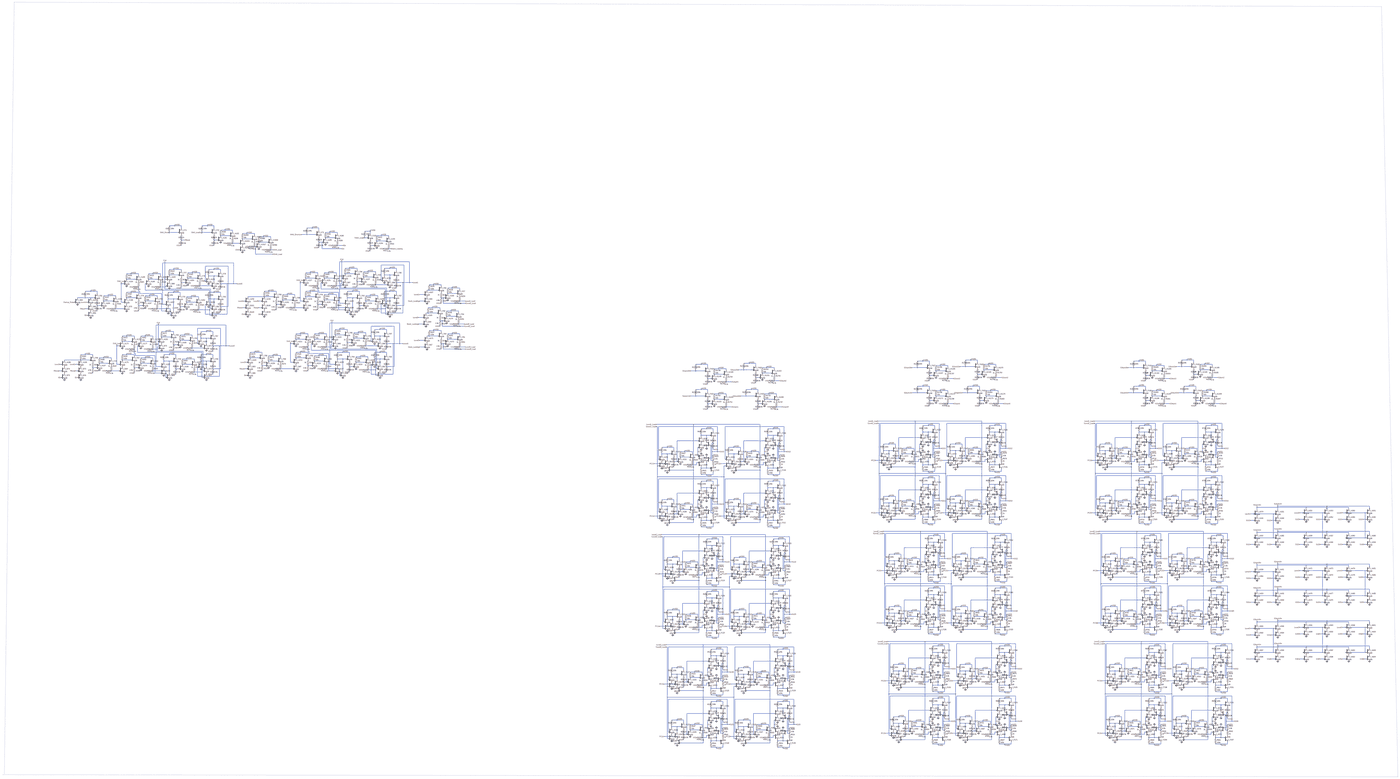
[diagram p0: schematic stack.asc, whole sheet]
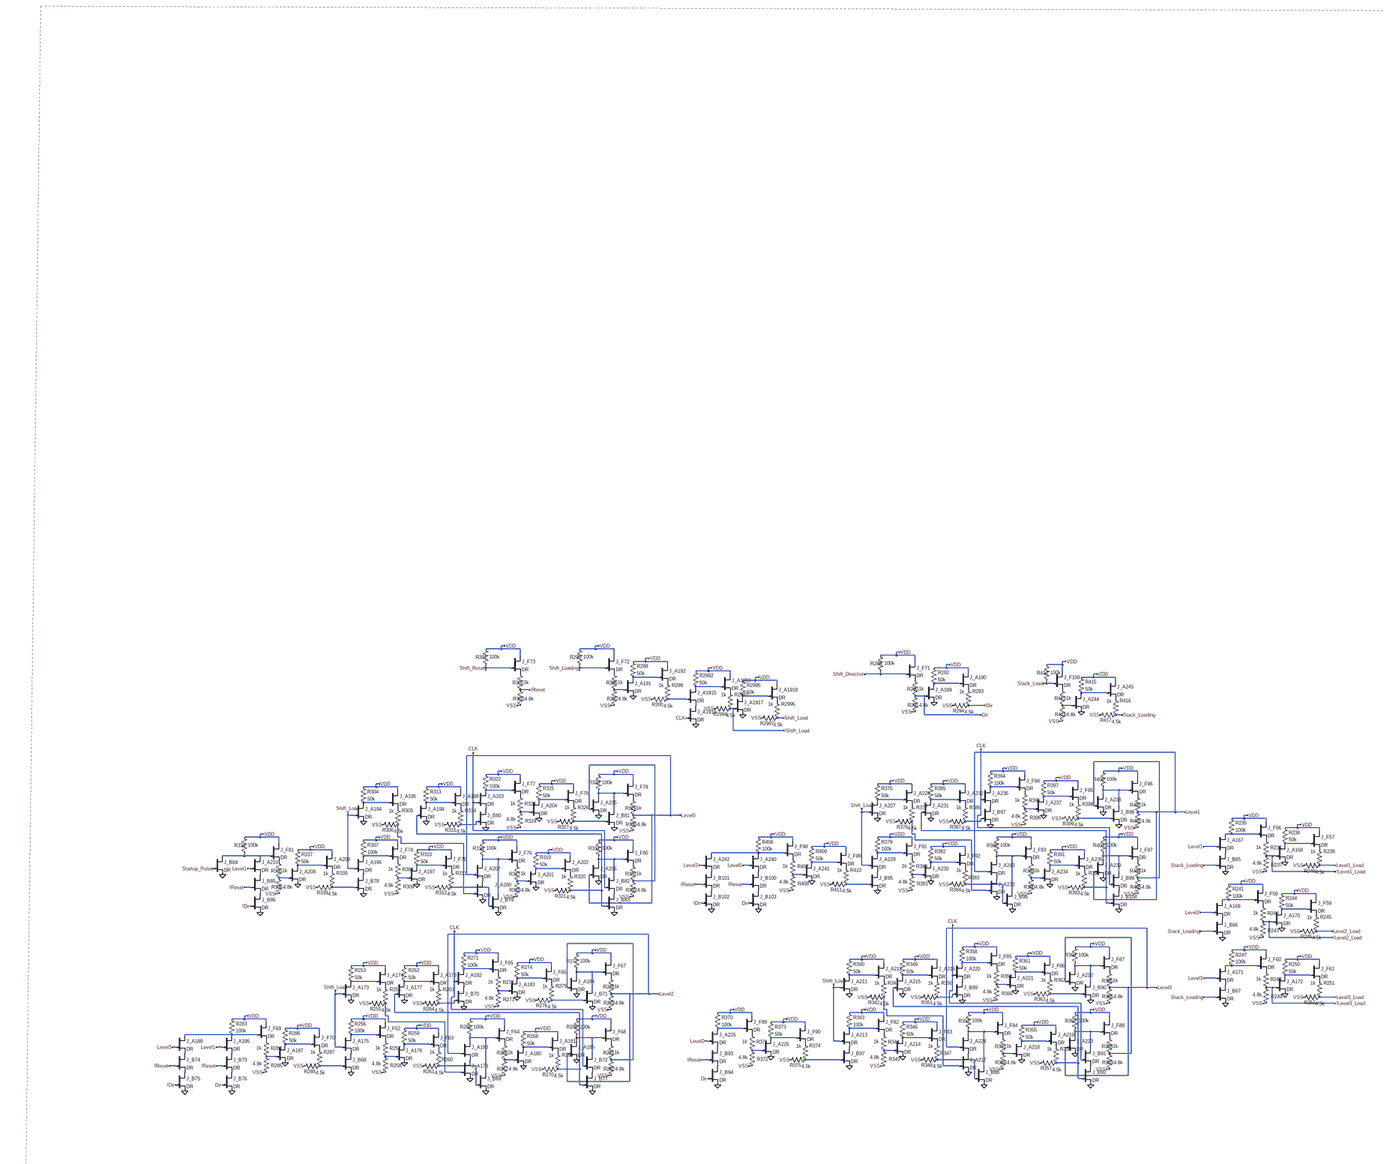
[diagram p1: schematic stack.asc, part, row 1 of 2, column 1 of 3]
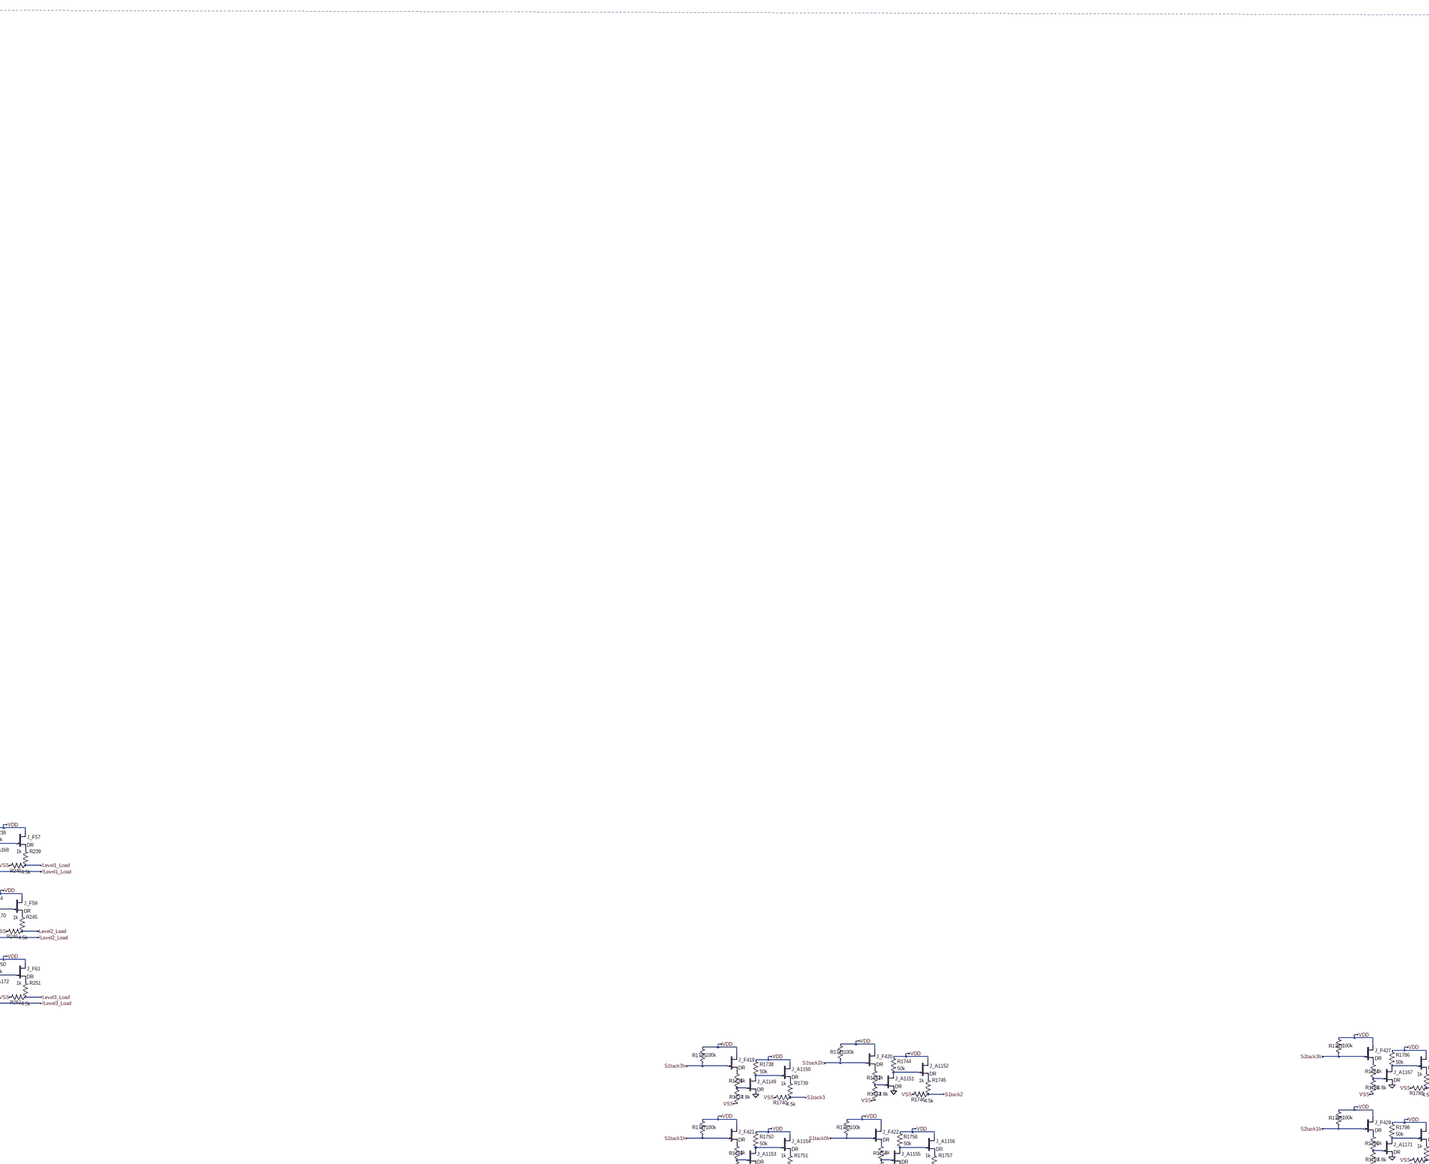
[diagram p2: schematic stack.asc, part, row 1 of 2, column 2 of 3]
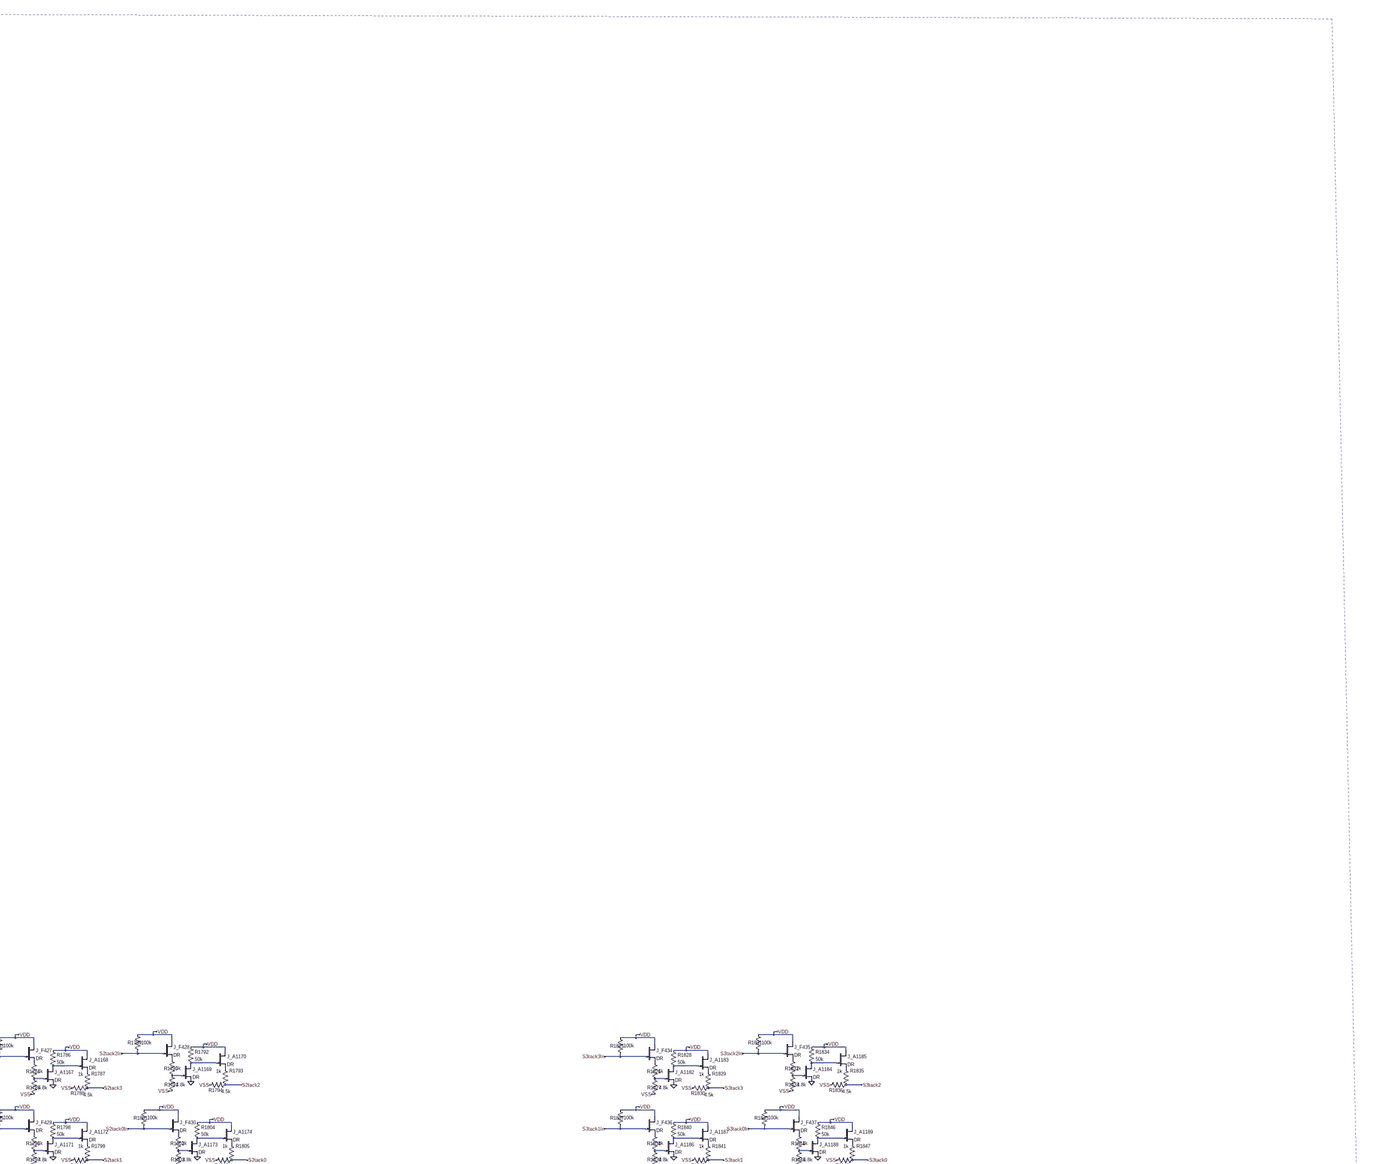
[diagram p3: schematic stack.asc, part, row 1 of 2, column 3 of 3]
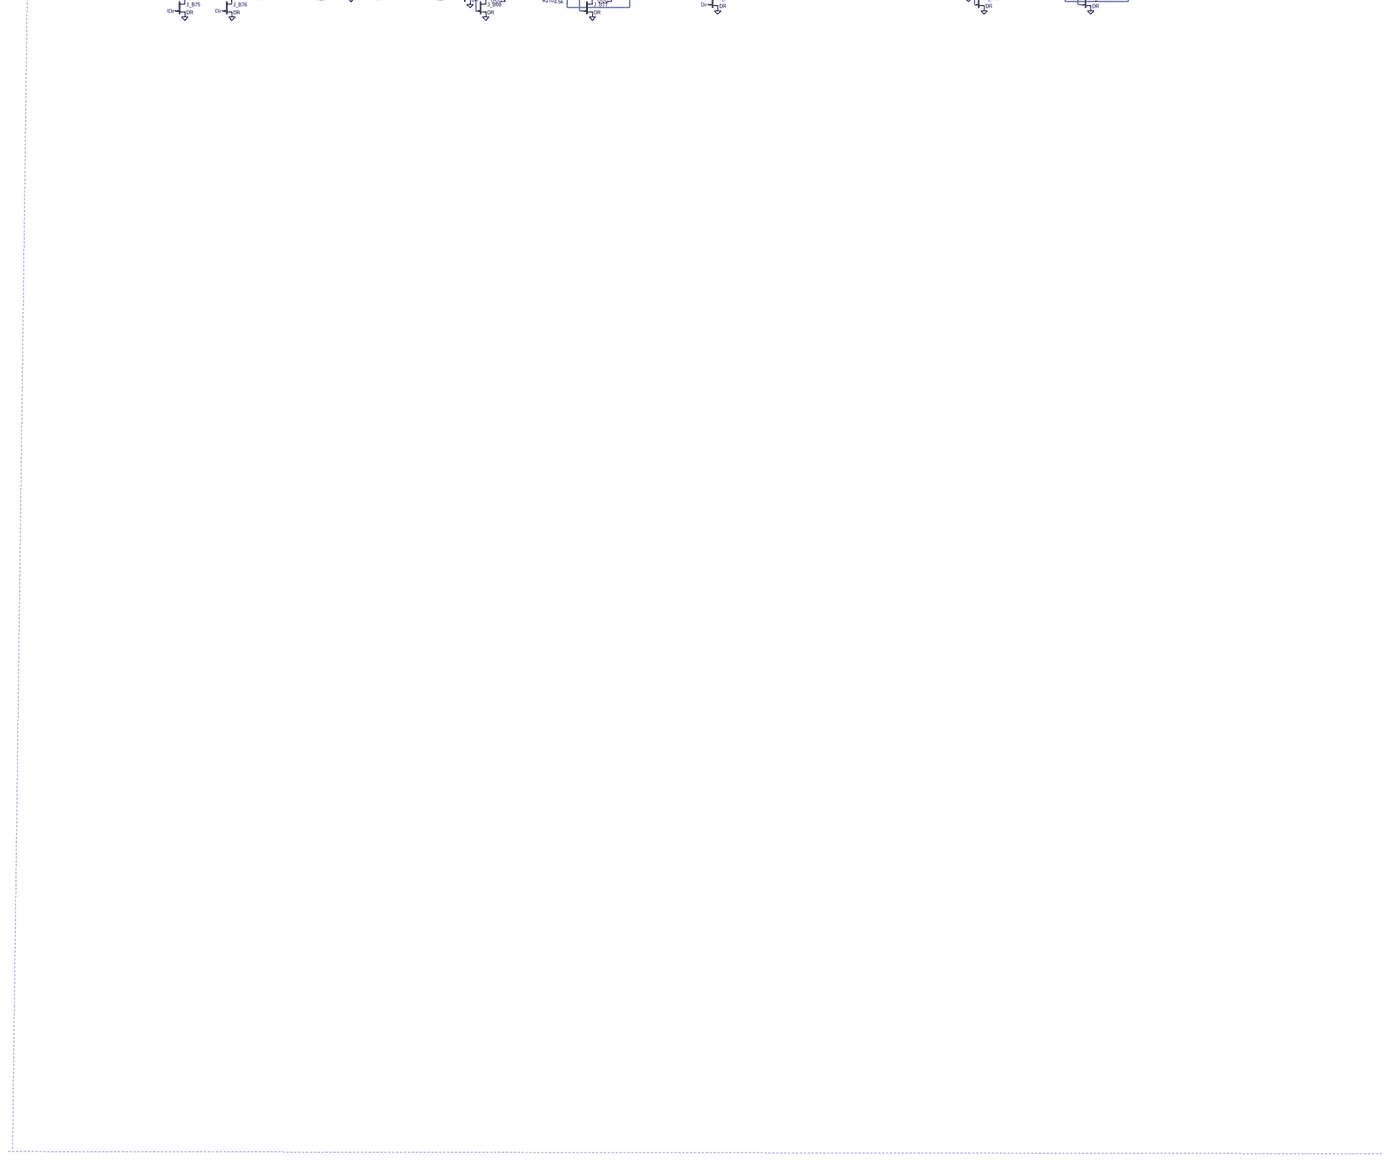
[diagram p4: schematic stack.asc, part, row 2 of 2, column 1 of 3]
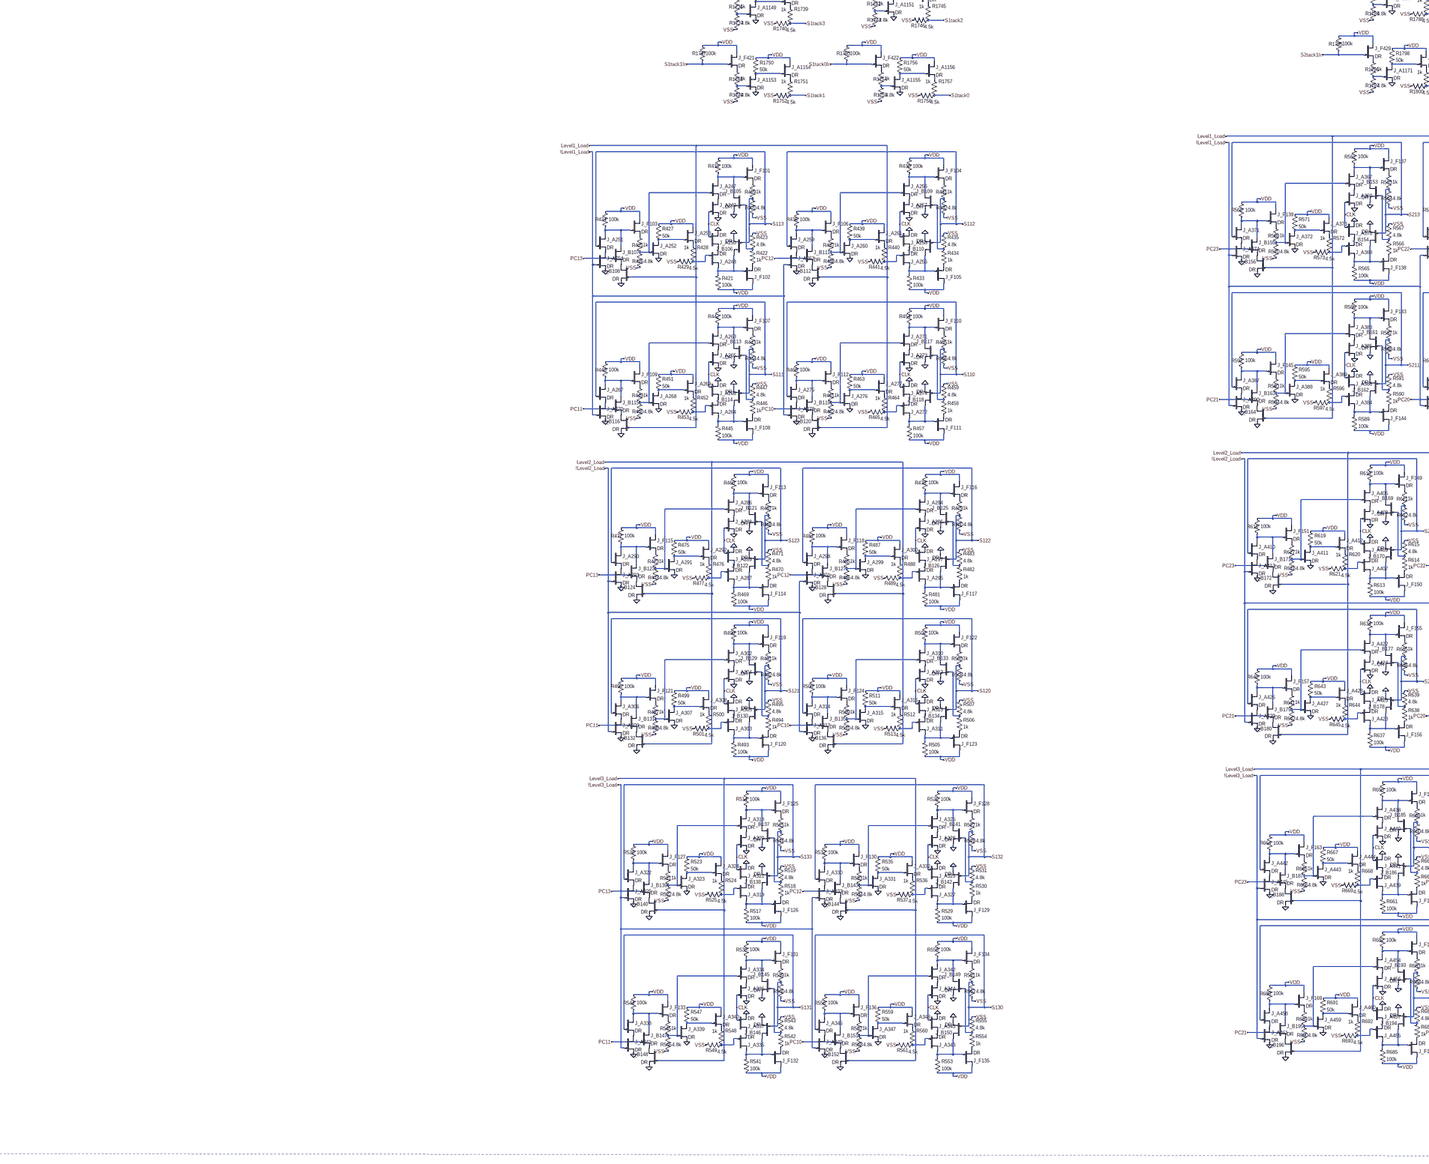
[diagram p5: schematic stack.asc, part, row 2 of 2, column 2 of 3]
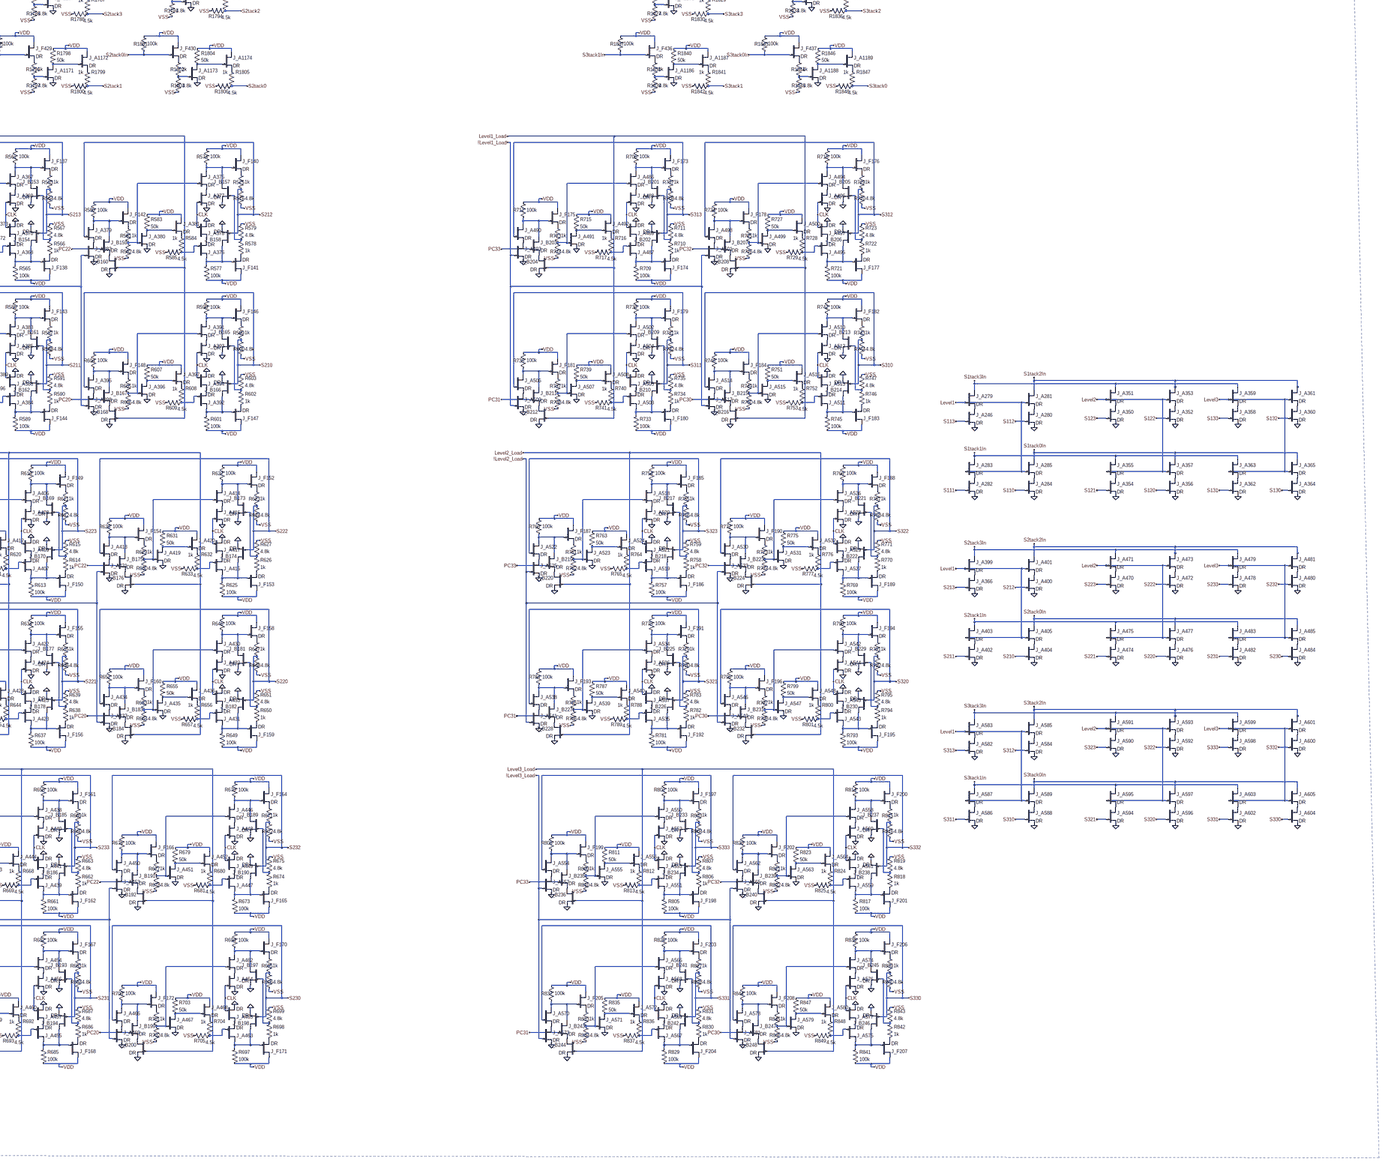
[diagram p6: schematic stack.asc, part, row 2 of 2, column 3 of 3]
* stack.asc
J_A167 N030 Level1 P001 DR
R235 VDD N030 100k
J_F56 VDD N030 P002 DR
R236 P002 !Level1_Load 1k
R237 !Level1_Load VSS 4.8k
J_B65 P001 Stack_Loading 0 DR
J_A168 N032 !Level1_Load 0 DR
R238 VDD N032 50k
J_F57 VDD N032 P003 DR
R239 P003 Level1_Load 1k
R240 Level1_Load VSS 4.5k
J_A169 N057 Level2 P004 DR
R241 VDD N057 100k
J_F58 VDD N057 P005 DR
R242 P005 !Level2_Load 1k
R243 !Level2_Load VSS 4.8k
J_B66 P004 Stack_Loading 0 DR
J_A170 N058 !Level2_Load 0 DR
R244 VDD N058 50k
J_F59 VDD N058 P006 DR
R245 P006 Level2_Load 1k
R246 Level2_Load VSS 4.5k
J_A171 N063 Level3 P007 DR
R247 VDD N063 100k
J_F60 VDD N063 P008 DR
R248 P008 !Level3_Load 1k
R249 !Level3_Load VSS 4.8k
J_B67 P007 Stack_Loading 0 DR
J_A172 N069 !Level3_Load 0 DR
R250 VDD N069 50k
J_F61 VDD N069 P009 DR
R251 P009 Level3_Load 1k
R252 Level3_Load VSS 4.5k
J_A173 N071 Shift_Load 0 DR
R253 VDD N071 50k
J_A174 VDD N071 P010 DR
R254 P010 N082 1k
R255 N082 VSS 4.5k
J_A175 N088 Shift_Load P011 DR
R256 VDD N088 100k
J_F62 VDD N088 P012 DR
R257 P012 N101 1k
R258 N101 VSS 4.8k
J_B68 P011 N107 0 DR
J_A176 N095 N101 0 DR
R259 VDD N095 50k
J_F63 VDD N095 P013 DR
R260 P013 N108 1k
R261 N108 VSS 4.5k
J_A177 N072 N081 0 DR
R262 VDD N072 50k
J_A178 VDD N072 P014 DR
R263 P014 N078 1k
R264 N078 VSS 4.5k
J_A179 P015 N082 0 DR
R265 VDD N089 100k
J_F64 VDD N089 P016 DR
R266 P016 N102 1k
R267 N102 VSS 4.8k
J_B69 N089 N108 0 DR
J_A180 N096 N102 0 DR
R268 VDD N096 50k
J_A181 VDD N096 P017 DR
R269 P017 N081 1k
R270 N081 VSS 4.5k
J_A182 N064 CLK P018 DR
R271 VDD N064 100k
J_F65 VDD N064 P019 DR
R272 P019 N074 1k
R273 N074 VSS 4.8k
J_B70 P018 N078 0 DR
J_A183 N070 N074 0 DR
R274 VDD N070 50k
J_F66 VDD N070 P020 DR
R275 P020 N077 1k
R276 N077 VSS 4.5k
J_A184 N065 N060 0 DR
R277 VDD N065 100k
J_F67 VDD N065 P021 DR
R278 P021 Level2 1k
R279 Level2 VSS 4.8k
J_B71 N065 N077 0 DR
J_A185 N090 Level2 0 DR
R280 VDD N090 100k
J_F68 VDD N090 P022 DR
R281 P022 N060 1k
R282 N060 VSS 4.8k
J_B72 N090 CLK P023 DR
J_A186 N087 Level1 P024 DR
R283 VDD N087 100k
J_F69 VDD N087 P025 DR
R284 P025 N100 1k
R285 N100 VSS 4.8k
J_B73 P024 !Reset P026 DR
J_A187 N094 N100 0 DR
R286 VDD N094 50k
J_F70 VDD N094 P027 DR
R287 P027 N107 1k
R288 N107 VSS 4.5k
J_A188 N087 Level3 P028 DR
J_B74 P028 !Reset P029 DR
J_B75 P029 !Dir 0 DR
J_B76 P026 Dir 0 DR
R289 VDD Shift_Direction 100k
J_F71 VDD Shift_Direction P030 DR
R290 P030 Dir 1k
R291 Dir VSS 4.8k
J_A189 N002 Dir 0 DR
R292 VDD N002 50k
J_A190 VDD N002 P031 DR
R293 P031 !Dir 1k
R294 !Dir VSS 4.5k
R295 VDD Shift_Loading 100k
J_F72 VDD Shift_Loading P032 DR
R296 P032 N004 1k
R297 N004 VSS 4.8k
J_A191 N001 N004 0 DR
R298 VDD N001 50k
J_A192 VDD N001 P033 DR
R299 P033 N007 1k
R300 N007 VSS 4.5k
R301 VDD Shift_Reset 100k
J_F73 VDD Shift_Reset P034 DR
R302 P034 !Reset 1k
R303 !Reset VSS 4.8k
J_A193 N089 Level2 P015 DR
J_B77 P023 N081 0 DR
J_A194 N019 Shift_Load 0 DR
R304 VDD N019 50k
J_A195 VDD N019 P035 DR
R305 P035 N031 1k
R306 N031 VSS 4.5k
J_A196 N036 Shift_Load P036 DR
R307 VDD N036 100k
J_F74 VDD N036 P037 DR
R308 P037 N050 1k
R309 N050 VSS 4.8k
J_B78 P036 N055 0 DR
J_A197 N044 N050 0 DR
R310 VDD N044 50k
J_F75 VDD N044 P038 DR
R311 P038 N056 1k
R312 N056 VSS 4.5k
J_A198 N020 N028 0 DR
R313 VDD N020 50k
J_A199 VDD N020 P039 DR
R314 P039 N026 1k
R315 N026 VSS 4.5k
J_A200 P040 N031 0 DR
R316 VDD N039 100k
J_F76 VDD N039 P041 DR
R317 P041 N052 1k
R318 N052 VSS 4.8k
J_B79 N039 N056 0 DR
J_A201 N046 N052 0 DR
R319 VDD N046 50k
J_A202 VDD N046 P042 DR
R320 P042 N028 1k
R321 N028 VSS 4.5k
J_A203 N012 CLK P043 DR
R322 VDD N012 100k
J_F77 VDD N012 P044 DR
R323 P044 N022 1k
R324 N022 VSS 4.8k
J_B80 P043 N026 0 DR
J_A204 N016 N022 0 DR
R325 VDD N016 50k
J_F78 VDD N016 P045 DR
R326 P045 N024 1k
R327 N024 VSS 4.5k
J_A205 N014 N010 0 DR
R328 VDD N014 100k
J_F79 VDD N014 P046 DR
R329 P046 Level0 1k
R330 Level0 VSS 4.8k
J_B81 N014 N024 0 DR
J_A206 N040 Level0 0 DR
R331 VDD N040 100k
J_F80 VDD N040 P047 DR
R332 P047 N010 1k
R333 N010 VSS 4.8k
J_B82 N040 CLK P048 DR
J_A207 N039 Level0 P040 DR
J_B83 P048 N028 0 DR
R334 VDD N035 100k
J_F81 VDD N035 P049 DR
R335 P049 N049 1k
R336 N049 VSS 4.8k
J_B84 N035 Startup_Pulse 0 DR
J_A208 N043 N049 0 DR
R337 VDD N043 50k
J_A209 VDD N043 P050 DR
R338 P050 N055 1k
R339 N055 VSS 4.5k
J_A210 N035 Level1 P051 DR
J_B85 P051 !Reset P052 DR
J_B86 P052 !Dir 0 DR
J_A211 N067 Shift_Load 0 DR
R340 VDD N067 50k
J_A212 VDD N067 P053 DR
R341 P053 N080 1k
R342 N080 VSS 4.5k
J_A213 N084 Shift_Load P054 DR
R343 VDD N084 100k
J_F82 VDD N084 P055 DR
R344 P055 N098 1k
R345 N098 VSS 4.8k
J_B87 P054 N103 0 DR
J_A214 N092 N098 0 DR
R346 VDD N092 50k
J_F83 VDD N092 P056 DR
R347 P056 N104 1k
R348 N104 VSS 4.5k
J_A215 N068 N079 0 DR
R349 VDD N068 50k
J_A216 VDD N068 P057 DR
R350 P057 N076 1k
R351 N076 VSS 4.5k
J_A217 P058 N080 0 DR
R352 VDD N085 100k
J_F84 VDD N085 P059 DR
R353 P059 N099 1k
R354 N099 VSS 4.8k
J_B88 N085 N104 0 DR
J_A218 N093 N099 0 DR
R355 VDD N093 50k
J_A219 VDD N093 P060 DR
R356 P060 N079 1k
R357 N079 VSS 4.5k
J_A220 N061 CLK P061 DR
R358 VDD N061 100k
J_F85 VDD N061 P062 DR
R359 P062 N073 1k
R360 N073 VSS 4.8k
J_B89 P061 N076 0 DR
J_A221 N066 N073 0 DR
R361 VDD N066 50k
J_F86 VDD N066 P063 DR
R362 P063 N075 1k
R363 N075 VSS 4.5k
J_A222 N062 N059 0 DR
R364 VDD N062 100k
J_F87 VDD N062 P064 DR
R365 P064 Level3 1k
R366 Level3 VSS 4.8k
J_B90 N062 N075 0 DR
J_A223 N086 Level3 0 DR
R367 VDD N086 100k
J_F88 VDD N086 P065 DR
R368 P065 N059 1k
R369 N059 VSS 4.8k
J_B91 N086 CLK P066 DR
J_A224 N085 Level3 P058 DR
J_B92 P066 N079 0 DR
J_A225 N083 Level2 P067 DR
R370 VDD N083 100k
J_F89 VDD N083 P068 DR
R371 P068 N097 1k
R372 N097 VSS 4.8k
J_B93 P067 !Reset P069 DR
J_A226 N091 N097 0 DR
R373 VDD N091 50k
J_F90 VDD N091 P070 DR
R374 P070 N103 1k
R375 N103 VSS 4.5k
J_B94 P069 Dir 0 DR
J_A227 N017 Shift_Load 0 DR
R376 VDD N017 50k
J_A228 VDD N017 P071 DR
R377 P071 N029 1k
R378 N029 VSS 4.5k
J_A229 N034 Shift_Load P072 DR
R379 VDD N034 100k
J_F91 VDD N034 P073 DR
R380 P073 N048 1k
R381 N048 VSS 4.8k
J_B95 P072 N053 0 DR
J_A230 N042 N048 0 DR
R382 VDD N042 50k
J_F92 VDD N042 P074 DR
R383 P074 N054 1k
R384 N054 VSS 4.5k
J_A231 N018 N027 0 DR
R385 VDD N018 50k
J_A232 VDD N018 P075 DR
R386 P075 N025 1k
R387 N025 VSS 4.5k
J_A233 P076 N029 0 DR
R388 VDD N037 100k
J_F93 VDD N037 P077 DR
R389 P077 N051 1k
R390 N051 VSS 4.8k
J_B96 N037 N054 0 DR
J_A234 N045 N051 0 DR
R391 VDD N045 50k
J_A235 VDD N045 P078 DR
R392 P078 N027 1k
R393 N027 VSS 4.5k
J_A236 N011 CLK P079 DR
R394 VDD N011 100k
J_F94 VDD N011 P080 DR
R395 P080 N021 1k
R396 N021 VSS 4.8k
J_B97 P079 N025 0 DR
J_A237 N015 N021 0 DR
R397 VDD N015 50k
J_F95 VDD N015 P081 DR
R398 P081 N023 1k
R399 N023 VSS 4.5k
J_A238 N013 N009 0 DR
R400 VDD N013 100k
J_F96 VDD N013 P082 DR
R401 P082 Level1 1k
R402 Level1 VSS 4.8k
J_B98 N013 N023 0 DR
J_A239 N038 Level1 0 DR
R403 VDD N038 100k
J_F97 VDD N038 P083 DR
R404 P083 N009 1k
R405 N009 VSS 4.8k
J_B99 N038 CLK P084 DR
J_A240 N033 Level0 P085 DR
R406 VDD N033 100k
J_F98 VDD N033 P086 DR
R407 P086 N047 1k
R408 N047 VSS 4.8k
J_B100 P085 !Reset P087 DR
J_A241 N041 N047 0 DR
R409 VDD N041 50k
J_F99 VDD N041 P088 DR
R410 P088 N053 1k
R411 N053 VSS 4.5k
J_A242 N033 Level2 P089 DR
J_B101 P089 !Reset P090 DR
J_B102 P090 !Dir 0 DR
J_B103 P087 Dir 0 DR
J_A243 N037 Level1 P076 DR
J_B104 P084 N027 0 DR
R412 VDD Stack_Load 100k
J_F100 VDD Stack_Load P091 DR
R413 P091 N008 1k
R414 N008 VSS 4.8k
J_A244 N005 N008 0 DR
R415 VDD N005 50k
J_A245 VDD N005 P092 DR
R416 P092 Stack_Loading 1k
R417 Stack_Loading VSS 4.5k
J_A246 P093 S113 0 DR
J_A247 N135 N141 P094 DR
R418 VDD N135 100k
J_F101 VDD N135 P095 DR
R419 P095 S113 1k
R420 S113 VSS 4.8k
J_B105 N135 N147 0 DR
J_A248 N171 N165 P096 DR
R421 VDD N171 100k
J_F102 VDD N171 P097 DR
R422 P097 N147 1k
R423 N147 VSS 4.8k
J_B106 N171 S113 0 DR
J_A249 P094 CLK 0 DR
J_A250 P096 CLK 0 DR
J_A251 N153 S113 P098 DR
R424 VDD N153 100k
J_F103 VDD N153 P099 DR
R425 P099 N141 1k
R426 N141 VSS 4.8k
J_B107 N153 PC13 P100 DR
J_A252 N159 N141 0 DR
R427 VDD N159 50k
J_A253 VDD N159 P101 DR
R428 P101 N165 1k
R429 N165 VSS 4.5k
J_A254 P098 !Level1_Load 0 DR
J_B108 P100 Level1_Load 0 DR
J_A255 N136 N142 P102 DR
R430 VDD N136 100k
J_F104 VDD N136 P103 DR
R431 P103 S112 1k
R432 S112 VSS 4.8k
J_B109 N136 N148 0 DR
J_A256 N172 N166 P104 DR
R433 VDD N172 100k
J_F105 VDD N172 P105 DR
R434 P105 N148 1k
R435 N148 VSS 4.8k
J_B110 N172 S112 0 DR
J_A257 P102 CLK 0 DR
J_A258 P104 CLK 0 DR
J_A259 N154 S112 P106 DR
R436 VDD N154 100k
J_F106 VDD N154 P107 DR
R437 P107 N142 1k
R438 N142 VSS 4.8k
J_B111 N154 PC12 P108 DR
J_A260 N160 N142 0 DR
R439 VDD N160 50k
J_A261 VDD N160 P109 DR
R440 P109 N166 1k
R441 N166 VSS 4.5k
J_A262 P106 !Level1_Load 0 DR
J_B112 P108 Level1_Load 0 DR
J_A263 N177 N183 P110 DR
R442 VDD N177 100k
J_F107 VDD N177 P111 DR
R443 P111 S111 1k
R444 S111 VSS 4.8k
J_B113 N177 N189 0 DR
J_A264 N213 N207 P112 DR
R445 VDD N213 100k
J_F108 VDD N213 P113 DR
R446 P113 N189 1k
R447 N189 VSS 4.8k
J_B114 N213 S111 0 DR
J_A265 P110 CLK 0 DR
J_A266 P112 CLK 0 DR
J_A267 N195 S111 P114 DR
R448 VDD N195 100k
J_F109 VDD N195 P115 DR
R449 P115 N183 1k
R450 N183 VSS 4.8k
J_B115 N195 PC11 P116 DR
J_A268 N201 N183 0 DR
R451 VDD N201 50k
J_A269 VDD N201 P117 DR
R452 P117 N207 1k
R453 N207 VSS 4.5k
J_A270 P114 !Level1_Load 0 DR
J_B116 P116 Level1_Load 0 DR
J_A271 N178 N184 P118 DR
R454 VDD N178 100k
J_F110 VDD N178 P119 DR
R455 P119 S110 1k
R456 S110 VSS 4.8k
J_B117 N178 N190 0 DR
J_A272 N214 N208 P120 DR
R457 VDD N214 100k
J_F111 VDD N214 P121 DR
R458 P121 N190 1k
R459 N190 VSS 4.8k
J_B118 N214 S110 0 DR
J_A273 P118 CLK 0 DR
J_A274 P120 CLK 0 DR
J_A275 N196 S110 P122 DR
R460 VDD N196 100k
J_F112 VDD N196 P123 DR
R461 P123 N184 1k
R462 N184 VSS 4.8k
J_B119 N196 PC10 P124 DR
J_A276 N202 N184 0 DR
R463 VDD N202 50k
J_A277 VDD N202 P125 DR
R464 P125 N208 1k
R465 N208 VSS 4.5k
J_A278 P122 !Level1_Load 0 DR
J_B120 P124 Level1_Load 0 DR
J_A279 S1tack3In Level1 P093 DR
J_A280 P126 S112 0 DR
J_A281 S1tack2In Level1 P126 DR
J_A282 P127 S111 0 DR
J_A283 S1tack1In Level1 P127 DR
J_A284 P128 S110 0 DR
J_A285 S1tack0In Level1 P128 DR
J_A286 N219 N225 P129 DR
R466 VDD N219 100k
J_F113 VDD N219 P130 DR
R467 P130 S123 1k
R468 S123 VSS 4.8k
J_B121 N219 N231 0 DR
J_A287 N255 N249 P131 DR
R469 VDD N255 100k
J_F114 VDD N255 P132 DR
R470 P132 N231 1k
R471 N231 VSS 4.8k
J_B122 N255 S123 0 DR
J_A288 P129 CLK 0 DR
J_A289 P131 CLK 0 DR
J_A290 N237 S123 P133 DR
R472 VDD N237 100k
J_F115 VDD N237 P134 DR
R473 P134 N225 1k
R474 N225 VSS 4.8k
J_B123 N237 PC13 P135 DR
J_A291 N243 N225 0 DR
R475 VDD N243 50k
J_A292 VDD N243 P136 DR
R476 P136 N249 1k
R477 N249 VSS 4.5k
J_A293 P133 !Level2_Load 0 DR
J_B124 P135 Level2_Load 0 DR
J_A294 N220 N226 P137 DR
R478 VDD N220 100k
J_F116 VDD N220 P138 DR
R479 P138 S122 1k
R480 S122 VSS 4.8k
J_B125 N220 N232 0 DR
J_A295 N256 N250 P139 DR
R481 VDD N256 100k
J_F117 VDD N256 P140 DR
R482 P140 N232 1k
R483 N232 VSS 4.8k
J_B126 N256 S122 0 DR
J_A296 P137 CLK 0 DR
J_A297 P139 CLK 0 DR
J_A298 N238 S122 P141 DR
R484 VDD N238 100k
J_F118 VDD N238 P142 DR
R485 P142 N226 1k
R486 N226 VSS 4.8k
J_B127 N238 PC12 P143 DR
J_A299 N244 N226 0 DR
R487 VDD N244 50k
J_A300 VDD N244 P144 DR
R488 P144 N250 1k
R489 N250 VSS 4.5k
J_A301 P141 !Level2_Load 0 DR
J_B128 P143 Level2_Load 0 DR
J_A302 N261 N267 P145 DR
R490 VDD N261 100k
J_F119 VDD N261 P146 DR
R491 P146 S121 1k
R492 S121 VSS 4.8k
J_B129 N261 N273 0 DR
J_A303 N297 N291 P147 DR
R493 VDD N297 100k
J_F120 VDD N297 P148 DR
R494 P148 N273 1k
R495 N273 VSS 4.8k
J_B130 N297 S121 0 DR
J_A304 P145 CLK 0 DR
J_A305 P147 CLK 0 DR
J_A306 N279 S121 P149 DR
R496 VDD N279 100k
J_F121 VDD N279 P150 DR
R497 P150 N267 1k
R498 N267 VSS 4.8k
J_B131 N279 PC11 P151 DR
J_A307 N285 N267 0 DR
R499 VDD N285 50k
J_A308 VDD N285 P152 DR
R500 P152 N291 1k
R501 N291 VSS 4.5k
J_A309 P149 !Level2_Load 0 DR
J_B132 P151 Level2_Load 0 DR
J_A310 N262 N268 P153 DR
R502 VDD N262 100k
J_F122 VDD N262 P154 DR
R503 P154 S120 1k
R504 S120 VSS 4.8k
J_B133 N262 N274 0 DR
J_A311 N298 N292 P155 DR
R505 VDD N298 100k
J_F123 VDD N298 P156 DR
R506 P156 N274 1k
R507 N274 VSS 4.8k
J_B134 N298 S120 0 DR
J_A312 P153 CLK 0 DR
J_A313 P155 CLK 0 DR
J_A314 N280 S120 P157 DR
R508 VDD N280 100k
J_F124 VDD N280 P158 DR
R509 P158 N268 1k
R510 N268 VSS 4.8k
J_B135 N280 PC10 P159 DR
J_A315 N286 N268 0 DR
R511 VDD N286 50k
J_A316 VDD N286 P160 DR
R512 P160 N292 1k
R513 N292 VSS 4.5k
J_A317 P157 !Level2_Load 0 DR
J_B136 P159 Level2_Load 0 DR
J_A318 N303 N309 P161 DR
R514 VDD N303 100k
J_F125 VDD N303 P162 DR
R515 P162 S133 1k
R516 S133 VSS 4.8k
J_B137 N303 N315 0 DR
J_A319 N339 N333 P163 DR
R517 VDD N339 100k
J_F126 VDD N339 P164 DR
R518 P164 N315 1k
R519 N315 VSS 4.8k
J_B138 N339 S133 0 DR
J_A320 P161 CLK 0 DR
J_A321 P163 CLK 0 DR
J_A322 N321 S133 P165 DR
R520 VDD N321 100k
J_F127 VDD N321 P166 DR
R521 P166 N309 1k
R522 N309 VSS 4.8k
J_B139 N321 PC13 P167 DR
J_A323 N327 N309 0 DR
R523 VDD N327 50k
J_A324 VDD N327 P168 DR
R524 P168 N333 1k
R525 N333 VSS 4.5k
J_A325 P165 !Level3_Load 0 DR
J_B140 P167 Level3_Load 0 DR
J_A326 N304 N310 P169 DR
R526 VDD N304 100k
J_F128 VDD N304 P170 DR
R527 P170 S132 1k
R528 S132 VSS 4.8k
J_B141 N304 N316 0 DR
J_A327 N340 N334 P171 DR
R529 VDD N340 100k
J_F129 VDD N340 P172 DR
R530 P172 N316 1k
R531 N316 VSS 4.8k
J_B142 N340 S132 0 DR
J_A328 P169 CLK 0 DR
J_A329 P171 CLK 0 DR
J_A330 N322 S132 P173 DR
R532 VDD N322 100k
J_F130 VDD N322 P174 DR
R533 P174 N310 1k
R534 N310 VSS 4.8k
J_B143 N322 PC12 P175 DR
J_A331 N328 N310 0 DR
R535 VDD N328 50k
J_A332 VDD N328 P176 DR
R536 P176 N334 1k
R537 N334 VSS 4.5k
J_A333 P173 !Level3_Load 0 DR
J_B144 P175 Level3_Load 0 DR
J_A334 N345 N351 P177 DR
R538 VDD N345 100k
J_F131 VDD N345 P178 DR
R539 P178 S131 1k
R540 S131 VSS 4.8k
J_B145 N345 N357 0 DR
J_A335 N381 N375 P179 DR
R541 VDD N381 100k
J_F132 VDD N381 P180 DR
R542 P180 N357 1k
R543 N357 VSS 4.8k
J_B146 N381 S131 0 DR
J_A336 P177 CLK 0 DR
J_A337 P179 CLK 0 DR
J_A338 N363 S131 P181 DR
R544 VDD N363 100k
J_F133 VDD N363 P182 DR
R545 P182 N351 1k
R546 N351 VSS 4.8k
J_B147 N363 PC11 P183 DR
J_A339 N369 N351 0 DR
R547 VDD N369 50k
J_A340 VDD N369 P184 DR
R548 P184 N375 1k
R549 N375 VSS 4.5k
J_A341 P181 !Level3_Load 0 DR
J_B148 P183 Level3_Load 0 DR
J_A342 N346 N352 P185 DR
R550 VDD N346 100k
J_F134 VDD N346 P186 DR
R551 P186 S130 1k
R552 S130 VSS 4.8k
J_B149 N346 N358 0 DR
J_A343 N382 N376 P187 DR
R553 VDD N382 100k
J_F135 VDD N382 P188 DR
R554 P188 N358 1k
R555 N358 VSS 4.8k
J_B150 N382 S130 0 DR
J_A344 P185 CLK 0 DR
J_A345 P187 CLK 0 DR
J_A346 N364 S130 P189 DR
R556 VDD N364 100k
J_F136 VDD N364 P190 DR
R557 P190 N352 1k
R558 N352 VSS 4.8k
J_B151 N364 PC10 P191 DR
J_A347 N370 N352 0 DR
R559 VDD N370 50k
J_A348 VDD N370 P192 DR
R560 P192 N376 1k
R561 N376 VSS 4.5k
J_A349 P189 !Level3_Load 0 DR
J_B152 P191 Level3_Load 0 DR
J_A350 P193 S123 0 DR
J_A351 S1tack3In Level2 P193 DR
J_A352 P194 S122 0 DR
J_A353 S1tack2In Level2 P194 DR
J_A354 P195 S121 0 DR
J_A355 S1tack1In Level2 P195 DR
J_A356 P196 S120 0 DR
J_A357 S1tack0In Level2 P196 DR
J_A358 P197 S133 0 DR
J_A359 S1tack3In Level3 P197 DR
J_A360 P198 S132 0 DR
J_A361 S1tack2In Level3 P198 DR
J_A362 P199 S131 0 DR
J_A363 S1tack1In Level3 P199 DR
J_A364 P200 S130 0 DR
J_A365 S1tack0In Level3 P200 DR
J_A366 P201 S213 0 DR
J_A367 N131 N137 P202 DR
R562 VDD N131 100k
J_F137 VDD N131 P203 DR
R563 P203 S213 1k
R564 S213 VSS 4.8k
J_B153 N131 N143 0 DR
J_A368 N167 N161 P204 DR
R565 VDD N167 100k
J_F138 VDD N167 P205 DR
R566 P205 N143 1k
R567 N143 VSS 4.8k
J_B154 N167 S213 0 DR
J_A369 P202 CLK 0 DR
J_A370 P204 CLK 0 DR
J_A371 N149 S213 P206 DR
R568 VDD N149 100k
J_F139 VDD N149 P207 DR
R569 P207 N137 1k
R570 N137 VSS 4.8k
J_B155 N149 PC23 P208 DR
J_A372 N155 N137 0 DR
R571 VDD N155 50k
J_A373 VDD N155 P209 DR
R572 P209 N161 1k
R573 N161 VSS 4.5k
J_A374 P206 !Level1_Load 0 DR
J_B156 P208 Level1_Load 0 DR
J_A375 N132 N138 P210 DR
R574 VDD N132 100k
J_F140 VDD N132 P211 DR
R575 P211 S212 1k
R576 S212 VSS 4.8k
J_B157 N132 N144 0 DR
J_A376 N168 N162 P212 DR
R577 VDD N168 100k
J_F141 VDD N168 P213 DR
R578 P213 N144 1k
R579 N144 VSS 4.8k
J_B158 N168 S212 0 DR
J_A377 P210 CLK 0 DR
J_A378 P212 CLK 0 DR
J_A379 N150 S212 P214 DR
R580 VDD N150 100k
J_F142 VDD N150 P215 DR
R581 P215 N138 1k
R582 N138 VSS 4.8k
J_B159 N150 PC22 P216 DR
J_A380 N156 N138 0 DR
R583 VDD N156 50k
J_A381 VDD N156 P217 DR
R584 P217 N162 1k
R585 N162 VSS 4.5k
J_A382 P214 !Level1_Load 0 DR
J_B160 P216 Level1_Load 0 DR
J_A383 N173 N179 P218 DR
R586 VDD N173 100k
J_F143 VDD N173 P219 DR
R587 P219 S211 1k
R588 S211 VSS 4.8k
J_B161 N173 N185 0 DR
J_A384 N209 N203 P220 DR
R589 VDD N209 100k
J_F144 VDD N209 P221 DR
R590 P221 N185 1k
R591 N185 VSS 4.8k
J_B162 N209 S211 0 DR
J_A385 P218 CLK 0 DR
J_A386 P220 CLK 0 DR
J_A387 N191 S211 P222 DR
R592 VDD N191 100k
J_F145 VDD N191 P223 DR
R593 P223 N179 1k
R594 N179 VSS 4.8k
J_B163 N191 PC21 P224 DR
J_A388 N197 N179 0 DR
R595 VDD N197 50k
J_A389 VDD N197 P225 DR
R596 P225 N203 1k
R597 N203 VSS 4.5k
J_A390 P222 !Level1_Load 0 DR
J_B164 P224 Level1_Load 0 DR
J_A391 N174 N180 P226 DR
R598 VDD N174 100k
J_F146 VDD N174 P227 DR
R599 P227 S210 1k
R600 S210 VSS 4.8k
J_B165 N174 N186 0 DR
J_A392 N210 N204 P228 DR
R601 VDD N210 100k
J_F147 VDD N210 P229 DR
R602 P229 N186 1k
R603 N186 VSS 4.8k
J_B166 N210 S210 0 DR
J_A393 P226 CLK 0 DR
J_A394 P228 CLK 0 DR
J_A395 N192 S210 P230 DR
R604 VDD N192 100k
J_F148 VDD N192 P231 DR
R605 P231 N180 1k
R606 N180 VSS 4.8k
J_B167 N192 PC20 P232 DR
J_A396 N198 N180 0 DR
R607 VDD N198 50k
J_A397 VDD N198 P233 DR
R608 P233 N204 1k
R609 N204 VSS 4.5k
J_A398 P230 !Level1_Load 0 DR
J_B168 P232 Level1_Load 0 DR
J_A399 S2tack3In Level1 P201 DR
J_A400 P234 S212 0 DR
J_A401 S2tack2In Level1 P234 DR
J_A402 P235 S211 0 DR
J_A403 S2tack1In Level1 P235 DR
J_A404 P236 S210 0 DR
J_A405 S2tack0In Level1 P236 DR
J_A406 N215 N221 P237 DR
R610 VDD N215 100k
J_F149 VDD N215 P238 DR
R611 P238 S223 1k
R612 S223 VSS 4.8k
J_B169 N215 N227 0 DR
J_A407 N251 N245 P239 DR
R613 VDD N251 100k
J_F150 VDD N251 P240 DR
R614 P240 N227 1k
R615 N227 VSS 4.8k
J_B170 N251 S223 0 DR
J_A408 P237 CLK 0 DR
J_A409 P239 CLK 0 DR
J_A410 N233 S223 P241 DR
R616 VDD N233 100k
J_F151 VDD N233 P242 DR
R617 P242 N221 1k
R618 N221 VSS 4.8k
J_B171 N233 PC23 P243 DR
J_A411 N239 N221 0 DR
R619 VDD N239 50k
J_A412 VDD N239 P244 DR
R620 P244 N245 1k
R621 N245 VSS 4.5k
J_A413 P241 !Level2_Load 0 DR
J_B172 P243 Level2_Load 0 DR
J_A414 N216 N222 P245 DR
R622 VDD N216 100k
J_F152 VDD N216 P246 DR
R623 P246 S222 1k
R624 S222 VSS 4.8k
J_B173 N216 N228 0 DR
J_A415 N252 N246 P247 DR
R625 VDD N252 100k
J_F153 VDD N252 P248 DR
R626 P248 N228 1k
R627 N228 VSS 4.8k
J_B174 N252 S222 0 DR
J_A416 P245 CLK 0 DR
J_A417 P247 CLK 0 DR
J_A418 N234 S222 P249 DR
R628 VDD N234 100k
J_F154 VDD N234 P250 DR
R629 P250 N222 1k
R630 N222 VSS 4.8k
J_B175 N234 PC22 P251 DR
J_A419 N240 N222 0 DR
R631 VDD N240 50k
J_A420 VDD N240 P252 DR
R632 P252 N246 1k
R633 N246 VSS 4.5k
J_A421 P249 !Level2_Load 0 DR
J_B176 P251 Level2_Load 0 DR
J_A422 N257 N263 P253 DR
R634 VDD N257 100k
J_F155 VDD N257 P254 DR
R635 P254 S221 1k
R636 S221 VSS 4.8k
J_B177 N257 N269 0 DR
J_A423 N293 N287 P255 DR
R637 VDD N293 100k
J_F156 VDD N293 P256 DR
R638 P256 N269 1k
R639 N269 VSS 4.8k
J_B178 N293 S221 0 DR
J_A424 P253 CLK 0 DR
J_A425 P255 CLK 0 DR
J_A426 N275 S221 P257 DR
R640 VDD N275 100k
J_F157 VDD N275 P258 DR
R641 P258 N263 1k
R642 N263 VSS 4.8k
J_B179 N275 PC21 P259 DR
J_A427 N281 N263 0 DR
R643 VDD N281 50k
J_A428 VDD N281 P260 DR
R644 P260 N287 1k
R645 N287 VSS 4.5k
J_A429 P257 !Level2_Load 0 DR
J_B180 P259 Level2_Load 0 DR
J_A430 N258 N264 P261 DR
R646 VDD N258 100k
J_F158 VDD N258 P262 DR
R647 P262 S220 1k
R648 S220 VSS 4.8k
J_B181 N258 N270 0 DR
J_A431 N294 N288 P263 DR
R649 VDD N294 100k
J_F159 VDD N294 P264 DR
R650 P264 N270 1k
R651 N270 VSS 4.8k
J_B182 N294 S220 0 DR
J_A432 P261 CLK 0 DR
J_A433 P263 CLK 0 DR
J_A434 N276 S220 P265 DR
R652 VDD N276 100k
J_F160 VDD N276 P266 DR
R653 P266 N264 1k
R654 N264 VSS 4.8k
J_B183 N276 PC20 P267 DR
J_A435 N282 N264 0 DR
R655 VDD N282 50k
J_A436 VDD N282 P268 DR
R656 P268 N288 1k
R657 N288 VSS 4.5k
J_A437 P265 !Level2_Load 0 DR
J_B184 P267 Level2_Load 0 DR
J_A438 N299 N305 P269 DR
R658 VDD N299 100k
J_F161 VDD N299 P270 DR
R659 P270 S233 1k
R660 S233 VSS 4.8k
J_B185 N299 N311 0 DR
J_A439 N335 N329 P271 DR
R661 VDD N335 100k
J_F162 VDD N335 P272 DR
R662 P272 N311 1k
R663 N311 VSS 4.8k
J_B186 N335 S233 0 DR
J_A440 P269 CLK 0 DR
J_A441 P271 CLK 0 DR
J_A442 N317 S233 P273 DR
R664 VDD N317 100k
J_F163 VDD N317 P274 DR
R665 P274 N305 1k
R666 N305 VSS 4.8k
J_B187 N317 PC23 P275 DR
J_A443 N323 N305 0 DR
R667 VDD N323 50k
J_A444 VDD N323 P276 DR
R668 P276 N329 1k
R669 N329 VSS 4.5k
J_A445 P273 !Level3_Load 0 DR
J_B188 P275 Level3_Load 0 DR
J_A446 N300 N306 P277 DR
R670 VDD N300 100k
J_F164 VDD N300 P278 DR
R671 P278 S232 1k
R672 S232 VSS 4.8k
J_B189 N300 N312 0 DR
J_A447 N336 N330 P279 DR
R673 VDD N336 100k
J_F165 VDD N336 P280 DR
R674 P280 N312 1k
R675 N312 VSS 4.8k
J_B190 N336 S232 0 DR
J_A448 P277 CLK 0 DR
J_A449 P279 CLK 0 DR
J_A450 N318 S232 P281 DR
R676 VDD N318 100k
J_F166 VDD N318 P282 DR
R677 P282 N306 1k
R678 N306 VSS 4.8k
J_B191 N318 PC22 P283 DR
J_A451 N324 N306 0 DR
R679 VDD N324 50k
J_A452 VDD N324 P284 DR
R680 P284 N330 1k
R681 N330 VSS 4.5k
J_A453 P281 !Level3_Load 0 DR
J_B192 P283 Level3_Load 0 DR
J_A454 N341 N347 P285 DR
R682 VDD N341 100k
J_F167 VDD N341 P286 DR
R683 P286 S231 1k
R684 S231 VSS 4.8k
J_B193 N341 N353 0 DR
J_A455 N377 N371 P287 DR
R685 VDD N377 100k
J_F168 VDD N377 P288 DR
R686 P288 N353 1k
R687 N353 VSS 4.8k
J_B194 N377 S231 0 DR
J_A456 P285 CLK 0 DR
J_A457 P287 CLK 0 DR
J_A458 N359 S231 P289 DR
R688 VDD N359 100k
J_F169 VDD N359 P290 DR
R689 P290 N347 1k
R690 N347 VSS 4.8k
J_B195 N359 PC21 P291 DR
J_A459 N365 N347 0 DR
R691 VDD N365 50k
J_A460 VDD N365 P292 DR
R692 P292 N371 1k
R693 N371 VSS 4.5k
J_A461 P289 !Level3_Load 0 DR
J_B196 P291 Level3_Load 0 DR
J_A462 N342 N348 P293 DR
R694 VDD N342 100k
J_F170 VDD N342 P294 DR
R695 P294 S230 1k
R696 S230 VSS 4.8k
J_B197 N342 N354 0 DR
J_A463 N378 N372 P295 DR
R697 VDD N378 100k
J_F171 VDD N378 P296 DR
R698 P296 N354 1k
R699 N354 VSS 4.8k
J_B198 N378 S230 0 DR
J_A464 P293 CLK 0 DR
J_A465 P295 CLK 0 DR
J_A466 N360 S230 P297 DR
R700 VDD N360 100k
J_F172 VDD N360 P298 DR
R701 P298 N348 1k
R702 N348 VSS 4.8k
J_B199 N360 PC20 P299 DR
J_A467 N366 N348 0 DR
R703 VDD N366 50k
J_A468 VDD N366 P300 DR
R704 P300 N372 1k
R705 N372 VSS 4.5k
J_A469 P297 !Level3_Load 0 DR
J_B200 P299 Level3_Load 0 DR
J_A470 P301 S223 0 DR
J_A471 S2tack3In Level2 P301 DR
J_A472 P302 S222 0 DR
J_A473 S2tack2In Level2 P302 DR
J_A474 P303 S221 0 DR
J_A475 S2tack1In Level2 P303 DR
J_A476 P304 S220 0 DR
J_A477 S2tack0In Level2 P304 DR
J_A478 P305 S233 0 DR
J_A479 S2tack3In Level3 P305 DR
J_A480 P306 S232 0 DR
J_A481 S2tack2In Level3 P306 DR
J_A482 P307 S231 0 DR
J_A483 S2tack1In Level3 P307 DR
J_A484 P308 S230 0 DR
J_A485 S2tack0In Level3 P308 DR
J_A486 N133 N139 P309 DR
R706 VDD N133 100k
J_F173 VDD N133 P310 DR
R707 P310 S313 1k
R708 S313 VSS 4.8k
J_B201 N133 N145 0 DR
J_A487 N169 N163 P311 DR
R709 VDD N169 100k
J_F174 VDD N169 P312 DR
R710 P312 N145 1k
R711 N145 VSS 4.8k
J_B202 N169 S313 0 DR
J_A488 P309 CLK 0 DR
J_A489 P311 CLK 0 DR
J_A490 N151 S313 P313 DR
R712 VDD N151 100k
J_F175 VDD N151 P314 DR
R713 P314 N139 1k
R714 N139 VSS 4.8k
J_B203 N151 PC33 P315 DR
J_A491 N157 N139 0 DR
R715 VDD N157 50k
J_A492 VDD N157 P316 DR
R716 P316 N163 1k
R717 N163 VSS 4.5k
J_A493 P313 !Level1_Load 0 DR
J_B204 P315 Level1_Load 0 DR
J_A494 N134 N140 P317 DR
R718 VDD N134 100k
J_F176 VDD N134 P318 DR
R719 P318 S312 1k
R720 S312 VSS 4.8k
J_B205 N134 N146 0 DR
J_A495 N170 N164 P319 DR
R721 VDD N170 100k
J_F177 VDD N170 P320 DR
R722 P320 N146 1k
R723 N146 VSS 4.8k
J_B206 N170 S312 0 DR
J_A496 P317 CLK 0 DR
J_A497 P319 CLK 0 DR
J_A498 N152 S312 P321 DR
R724 VDD N152 100k
J_F178 VDD N152 P322 DR
R725 P322 N140 1k
R726 N140 VSS 4.8k
J_B207 N152 PC32 P323 DR
J_A499 N158 N140 0 DR
R727 VDD N158 50k
J_A500 VDD N158 P324 DR
R728 P324 N164 1k
R729 N164 VSS 4.5k
J_A501 P321 !Level1_Load 0 DR
J_B208 P323 Level1_Load 0 DR
J_A502 N175 N181 P325 DR
R730 VDD N175 100k
J_F179 VDD N175 P326 DR
R731 P326 S311 1k
R732 S311 VSS 4.8k
J_B209 N175 N187 0 DR
J_A503 N211 N205 P327 DR
R733 VDD N211 100k
J_F180 VDD N211 P328 DR
R734 P328 N187 1k
R735 N187 VSS 4.8k
J_B210 N211 S311 0 DR
J_A504 P325 CLK 0 DR
J_A505 P327 CLK 0 DR
J_A506 N193 S311 P329 DR
R736 VDD N193 100k
J_F181 VDD N193 P330 DR
R737 P330 N181 1k
R738 N181 VSS 4.8k
J_B211 N193 PC31 P331 DR
J_A507 N199 N181 0 DR
R739 VDD N199 50k
J_A508 VDD N199 P332 DR
R740 P332 N205 1k
R741 N205 VSS 4.5k
J_A509 P329 !Level1_Load 0 DR
J_B212 P331 Level1_Load 0 DR
J_A510 N176 N182 P333 DR
R742 VDD N176 100k
J_F182 VDD N176 P334 DR
R743 P334 S310 1k
R744 S310 VSS 4.8k
J_B213 N176 N188 0 DR
J_A511 N212 N206 P335 DR
R745 VDD N212 100k
J_F183 VDD N212 P336 DR
R746 P336 N188 1k
R747 N188 VSS 4.8k
J_B214 N212 S310 0 DR
J_A512 P333 CLK 0 DR
J_A513 P335 CLK 0 DR
J_A514 N194 S310 P337 DR
R748 VDD N194 100k
J_F184 VDD N194 P338 DR
R749 P338 N182 1k
R750 N182 VSS 4.8k
J_B215 N194 PC30 P339 DR
J_A515 N200 N182 0 DR
R751 VDD N200 50k
J_A516 VDD N200 P340 DR
R752 P340 N206 1k
R753 N206 VSS 4.5k
J_A517 P337 !Level1_Load 0 DR
J_B216 P339 Level1_Load 0 DR
J_A518 N217 N223 P341 DR
R754 VDD N217 100k
J_F185 VDD N217 P342 DR
R755 P342 S323 1k
R756 S323 VSS 4.8k
J_B217 N217 N229 0 DR
J_A519 N253 N247 P343 DR
R757 VDD N253 100k
J_F186 VDD N253 P344 DR
R758 P344 N229 1k
R759 N229 VSS 4.8k
J_B218 N253 S323 0 DR
J_A520 P341 CLK 0 DR
J_A521 P343 CLK 0 DR
J_A522 N235 S323 P345 DR
R760 VDD N235 100k
J_F187 VDD N235 P346 DR
R761 P346 N223 1k
R762 N223 VSS 4.8k
J_B219 N235 PC33 P347 DR
J_A523 N241 N223 0 DR
R763 VDD N241 50k
J_A524 VDD N241 P348 DR
R764 P348 N247 1k
R765 N247 VSS 4.5k
J_A525 P345 !Level2_Load 0 DR
J_B220 P347 Level2_Load 0 DR
J_A526 N218 N224 P349 DR
R766 VDD N218 100k
J_F188 VDD N218 P350 DR
R767 P350 S322 1k
R768 S322 VSS 4.8k
J_B221 N218 N230 0 DR
J_A527 N254 N248 P351 DR
R769 VDD N254 100k
J_F189 VDD N254 P352 DR
R770 P352 N230 1k
R771 N230 VSS 4.8k
J_B222 N254 S322 0 DR
J_A528 P349 CLK 0 DR
J_A529 P351 CLK 0 DR
J_A530 N236 S322 P353 DR
R772 VDD N236 100k
J_F190 VDD N236 P354 DR
R773 P354 N224 1k
R774 N224 VSS 4.8k
J_B223 N236 PC32 P355 DR
J_A531 N242 N224 0 DR
R775 VDD N242 50k
J_A532 VDD N242 P356 DR
R776 P356 N248 1k
R777 N248 VSS 4.5k
J_A533 P353 !Level2_Load 0 DR
J_B224 P355 Level2_Load 0 DR
J_A534 N259 N265 P357 DR
R778 VDD N259 100k
J_F191 VDD N259 P358 DR
R779 P358 S321 1k
R780 S321 VSS 4.8k
J_B225 N259 N271 0 DR
J_A535 N295 N289 P359 DR
R781 VDD N295 100k
J_F192 VDD N295 P360 DR
R782 P360 N271 1k
R783 N271 VSS 4.8k
J_B226 N295 S321 0 DR
J_A536 P357 CLK 0 DR
J_A537 P359 CLK 0 DR
J_A538 N277 S321 P361 DR
R784 VDD N277 100k
J_F193 VDD N277 P362 DR
R785 P362 N265 1k
R786 N265 VSS 4.8k
J_B227 N277 PC31 P363 DR
J_A539 N283 N265 0 DR
R787 VDD N283 50k
J_A540 VDD N283 P364 DR
R788 P364 N289 1k
R789 N289 VSS 4.5k
J_A541 P361 !Level2_Load 0 DR
J_B228 P363 Level2_Load 0 DR
J_A542 N260 N266 P365 DR
R790 VDD N260 100k
J_F194 VDD N260 P366 DR
R791 P366 S320 1k
R792 S320 VSS 4.8k
J_B229 N260 N272 0 DR
J_A543 N296 N290 P367 DR
R793 VDD N296 100k
J_F195 VDD N296 P368 DR
R794 P368 N272 1k
R795 N272 VSS 4.8k
J_B230 N296 S320 0 DR
J_A544 P365 CLK 0 DR
J_A545 P367 CLK 0 DR
J_A546 N278 S320 P369 DR
R796 VDD N278 100k
J_F196 VDD N278 P370 DR
R797 P370 N266 1k
R798 N266 VSS 4.8k
J_B231 N278 PC30 P371 DR
J_A547 N284 N266 0 DR
R799 VDD N284 50k
J_A548 VDD N284 P372 DR
R800 P372 N290 1k
R801 N290 VSS 4.5k
J_A549 P369 !Level2_Load 0 DR
J_B232 P371 Level2_Load 0 DR
J_A550 N301 N307 P373 DR
R802 VDD N301 100k
J_F197 VDD N301 P374 DR
R803 P374 S333 1k
R804 S333 VSS 4.8k
J_B233 N301 N313 0 DR
J_A551 N337 N331 P375 DR
R805 VDD N337 100k
J_F198 VDD N337 P376 DR
R806 P376 N313 1k
R807 N313 VSS 4.8k
J_B234 N337 S333 0 DR
J_A552 P373 CLK 0 DR
J_A553 P375 CLK 0 DR
J_A554 N319 S333 P377 DR
R808 VDD N319 100k
J_F199 VDD N319 P378 DR
R809 P378 N307 1k
R810 N307 VSS 4.8k
J_B235 N319 PC33 P379 DR
J_A555 N325 N307 0 DR
R811 VDD N325 50k
J_A556 VDD N325 P380 DR
R812 P380 N331 1k
R813 N331 VSS 4.5k
J_A557 P377 !Level3_Load 0 DR
J_B236 P379 Level3_Load 0 DR
J_A558 N302 N308 P381 DR
R814 VDD N302 100k
J_F200 VDD N302 P382 DR
R815 P382 S332 1k
R816 S332 VSS 4.8k
J_B237 N302 N314 0 DR
J_A559 N338 N332 P383 DR
R817 VDD N338 100k
J_F201 VDD N338 P384 DR
R818 P384 N314 1k
R819 N314 VSS 4.8k
J_B238 N338 S332 0 DR
J_A560 P381 CLK 0 DR
J_A561 P383 CLK 0 DR
J_A562 N320 S332 P385 DR
R820 VDD N320 100k
J_F202 VDD N320 P386 DR
R821 P386 N308 1k
R822 N308 VSS 4.8k
J_B239 N320 PC32 P387 DR
J_A563 N326 N308 0 DR
R823 VDD N326 50k
J_A564 VDD N326 P388 DR
R824 P388 N332 1k
R825 N332 VSS 4.5k
J_A565 P385 !Level3_Load 0 DR
J_B240 P387 Level3_Load 0 DR
J_A566 N343 N349 P389 DR
R826 VDD N343 100k
J_F203 VDD N343 P390 DR
R827 P390 S331 1k
R828 S331 VSS 4.8k
J_B241 N343 N355 0 DR
J_A567 N379 N373 P391 DR
R829 VDD N379 100k
J_F204 VDD N379 P392 DR
R830 P392 N355 1k
R831 N355 VSS 4.8k
J_B242 N379 S331 0 DR
J_A568 P389 CLK 0 DR
J_A569 P391 CLK 0 DR
J_A570 N361 S331 P393 DR
R832 VDD N361 100k
J_F205 VDD N361 P394 DR
R833 P394 N349 1k
R834 N349 VSS 4.8k
J_B243 N361 PC31 P395 DR
J_A571 N367 N349 0 DR
R835 VDD N367 50k
J_A572 VDD N367 P396 DR
R836 P396 N373 1k
R837 N373 VSS 4.5k
J_A573 P393 !Level3_Load 0 DR
J_B244 P395 Level3_Load 0 DR
J_A574 N344 N350 P397 DR
R838 VDD N344 100k
J_F206 VDD N344 P398 DR
R839 P398 S330 1k
R840 S330 VSS 4.8k
J_B245 N344 N356 0 DR
J_A575 N380 N374 P399 DR
R841 VDD N380 100k
J_F207 VDD N380 P400 DR
R842 P400 N356 1k
R843 N356 VSS 4.8k
J_B246 N380 S330 0 DR
J_A576 P397 CLK 0 DR
J_A577 P399 CLK 0 DR
J_A578 N362 S330 P401 DR
R844 VDD N362 100k
J_F208 VDD N362 P402 DR
R845 P402 N350 1k
R846 N350 VSS 4.8k
J_B247 N362 PC30 P403 DR
J_A579 N368 N350 0 DR
R847 VDD N368 50k
J_A580 VDD N368 P404 DR
R848 P404 N374 1k
R849 N374 VSS 4.5k
J_A581 P401 !Level3_Load 0 DR
J_B248 P403 Level3_Load 0 DR
J_A582 P405 S313 0 DR
J_A583 S3tack3In Level1 P405 DR
J_A584 P406 S312 0 DR
J_A585 S3tack2In Level1 P406 DR
J_A586 P407 S311 0 DR
J_A587 S3tack1In Level1 P407 DR
J_A588 P408 S310 0 DR
J_A589 S3tack0In Level1 P408 DR
J_A590 P409 S323 0 DR
J_A591 S3tack3In Level2 P409 DR
J_A592 P410 S322 0 DR
J_A593 S3tack2In Level2 P410 DR
J_A594 P411 S321 0 DR
J_A595 S3tack1In Level2 P411 DR
J_A596 P412 S320 0 DR
J_A597 S3tack0In Level2 P412 DR
J_A598 P413 S333 0 DR
J_A599 S3tack3In Level3 P413 DR
J_A600 P414 S332 0 DR
J_A601 S3tack2In Level3 P414 DR
J_A602 P415 S331 0 DR
J_A603 S3tack1In Level3 P415 DR
J_A604 P416 S330 0 DR
J_A605 S3tack0In Level3 P416 DR
R1735 VDD S1tack3In 100k
J_F419 VDD S1tack3In P417 DR
R1736 P417 N118 1k
R1737 N118 VSS 4.8k
J_A1149 N112 N118 0 DR
R1738 VDD N112 50k
J_A1150 VDD N112 P418 DR
R1739 P418 S1tack3 1k
R1740 S1tack3 VSS 4.5k
R1741 VDD S1tack2In 100k
J_F420 VDD S1tack2In P419 DR
R1742 P419 N117 1k
R1743 N117 VSS 4.8k
J_A1151 N111 N117 0 DR
R1744 VDD N111 50k
J_A1152 VDD N111 P420 DR
R1745 P420 S1tack2 1k
R1746 S1tack2 VSS 4.5k
R1747 VDD S1tack1In 100k
J_F421 VDD S1tack1In P421 DR
R1748 P421 N129 1k
R1749 N129 VSS 4.8k
J_A1153 N123 N129 0 DR
R1750 VDD N123 50k
J_A1154 VDD N123 P422 DR
R1751 P422 S1tack1 1k
R1752 S1tack1 VSS 4.5k
R1753 VDD S1tack0In 100k
J_F422 VDD S1tack0In P423 DR
R1754 P423 N130 1k
R1755 N130 VSS 4.8k
J_A1155 N124 N130 0 DR
R1756 VDD N124 50k
J_A1156 VDD N124 P424 DR
R1757 P424 S1tack0 1k
R1758 S1tack0 VSS 4.5k
R1783 VDD S2tack3In 100k
J_F427 VDD S2tack3In P425 DR
R1784 P425 N115 1k
R1785 N115 VSS 4.8k
J_A1167 N109 N115 0 DR
R1786 VDD N109 50k
J_A1168 VDD N109 P426 DR
R1787 P426 S2tack3 1k
R1788 S2tack3 VSS 4.5k
R1789 VDD S2tack2In 100k
J_F428 VDD S2tack2In P427 DR
R1790 P427 N113 1k
R1791 N113 VSS 4.8k
J_A1169 N105 N113 0 DR
R1792 VDD N105 50k
J_A1170 VDD N105 P428 DR
R1793 P428 S2tack2 1k
R1794 S2tack2 VSS 4.5k
R1795 VDD S2tack1In 100k
J_F429 VDD S2tack1In P429 DR
R1796 P429 N125 1k
R1797 N125 VSS 4.8k
J_A1171 N119 N125 0 DR
R1798 VDD N119 50k
J_A1172 VDD N119 P430 DR
R1799 P430 S2tack1 1k
R1800 S2tack1 VSS 4.5k
R1801 VDD S2tack0In 100k
J_F430 VDD S2tack0In P431 DR
R1802 P431 N126 1k
R1803 N126 VSS 4.8k
J_A1173 N120 N126 0 DR
R1804 VDD N120 50k
J_A1174 VDD N120 P432 DR
R1805 P432 S2tack0 1k
R1806 S2tack0 VSS 4.5k
R1825 VDD S3tack3In 100k
J_F434 VDD S3tack3In P433 DR
R1826 P433 N116 1k
R1827 N116 VSS 4.8k
J_A1182 N110 N116 0 DR
R1828 VDD N110 50k
J_A1183 VDD N110 P434 DR
R1829 P434 S3tack3 1k
R1830 S3tack3 VSS 4.5k
R1831 VDD S3tack2In 100k
J_F435 VDD S3tack2In P435 DR
R1832 P435 N114 1k
R1833 N114 VSS 4.8k
J_A1184 N106 N114 0 DR
R1834 VDD N106 50k
J_A1185 VDD N106 P436 DR
R1835 P436 S3tack2 1k
R1836 S3tack2 VSS 4.5k
R1837 VDD S3tack1In 100k
J_F436 VDD S3tack1In P437 DR
R1838 P437 N127 1k
R1839 N127 VSS 4.8k
J_A1186 N121 N127 0 DR
R1840 VDD N121 50k
J_A1187 VDD N121 P438 DR
R1841 P438 S3tack1 1k
R1842 S3tack1 VSS 4.5k
R1843 VDD S3tack0In 100k
J_F437 VDD S3tack0In P439 DR
R1844 P439 N128 1k
R1845 N128 VSS 4.8k
J_A1188 N122 N128 0 DR
R1846 VDD N122 50k
J_A1189 VDD N122 P440 DR
R1847 P440 S3tack0 1k
R1848 S3tack0 VSS 4.5k
J_A1915 N003 N007 P441 DR
R2992 VDD N003 50k
J_A1916 VDD N003 P442 DR
R2993 P442 !Shift_Load 1k
R2994 !Shift_Load VSS 4.5k
J_A1917 N006 !Shift_Load 0 DR
R2995 VDD N006 50k
J_A1918 VDD N006 P443 DR
R2996 P443 Shift_Load 1k
R2997 Shift_Load VSS 4.5k
J_A1919 P441 CLK 0 DR
.model NJF NJF
.model PJF PJF
.lib standard.jft
.backanno
.end